# Altium schematic sheet PROGRAM.SchDoc
size 420 x 297 mm; Address1: Address1; Address2: Address2; Address3: Address3; Address4: Address4; DocumentNumber: Э3; SheetNumber: 5; SheetTotal: 5; Scale: 1:1; DocumentType: Схема электрическая принципиальная; FirstReferrence: АБВГ.123456.001
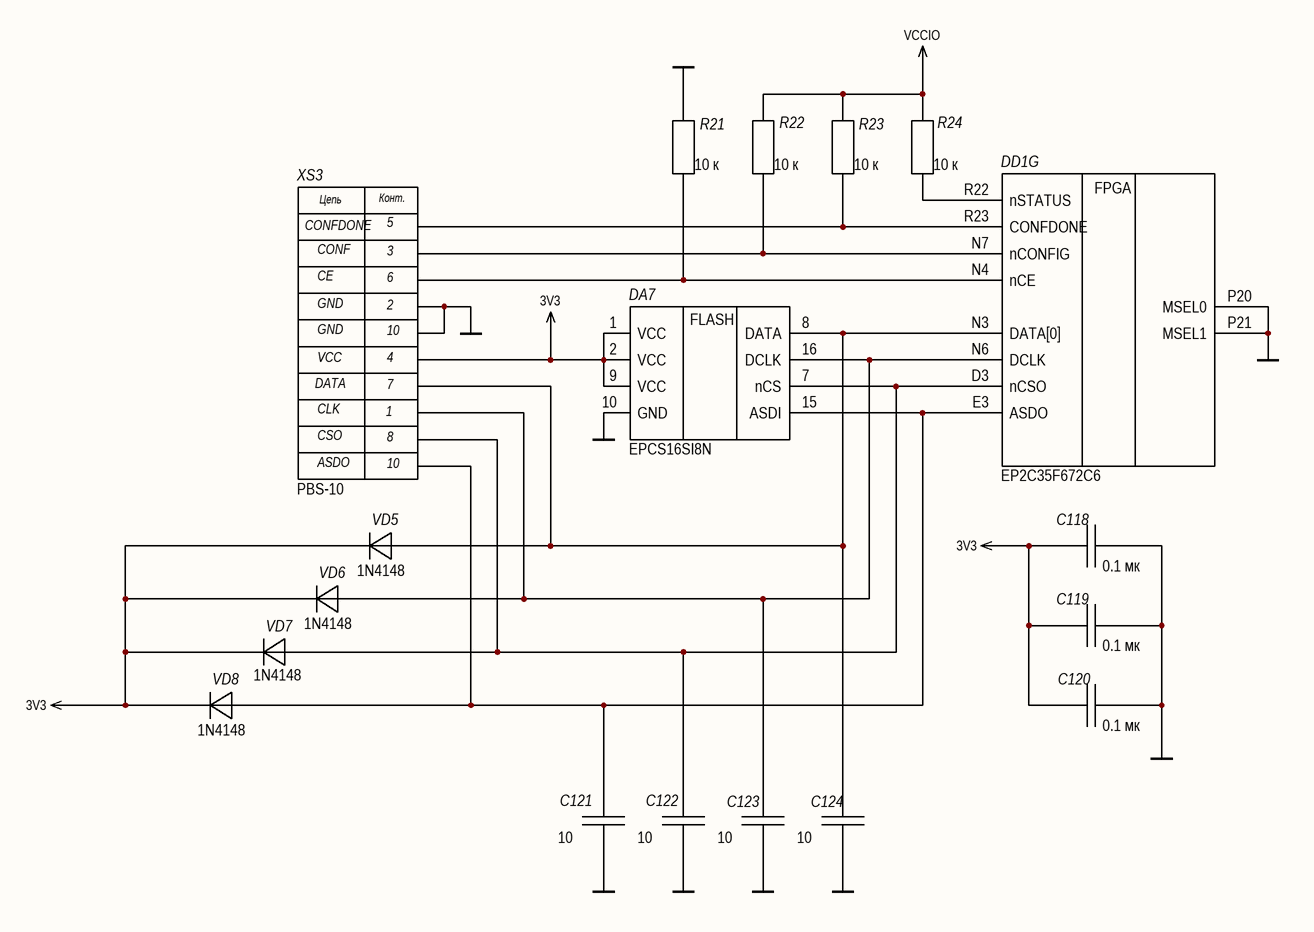
[diagram p0: PROGRAM.SchDoc]

## Parts
C118  (no value)
C119  (no value)
C120  (no value)
C121  (no value)
C122  (no value)
C123  (no value)
C124  (no value)
DA7  EPCS16SI8N
DD1  EP2C35F672C6  (part G of 7)
R21  (no value)
R22  (no value)
R23  (no value)
R24  (no value)
VD5  *  (value not drawn)
VD6  *  (value not drawn)
VD7  *  (value not drawn)
VD8  *  (value not drawn)
XS3  PBS-10

## Nets
3V3: C118.2 C119.2 C120.2 DA7.1(VCC) DA7.2(VCC) DA7.9(VCC) VD5.2 VD6.2 VD7.2 VD8.2 XS3.4
GND: C118.1 C119.1 C120.1 C121.1 C122.1 C123.1 C124.1 DA7.10(GND) DD1.P20(MSEL0) DD1.P21(MSEL1) R21.2 XS3.5 XS3.6
VCCIO: R22.2 R23.2 R24.2
NetC121_2: C121.2 DA7.15(ASDI) DD1.E3(ASDO) VD8.1 XS3.10
NetC122_2: C122.2 DA7.7(nCS) DD1.D3(nCSO) VD7.1 XS3.9
NetC123_2: C123.2 DA7.16(DCLK) DD1.N6(DCLK) VD6.1 XS3.7
NetC124_2: C124.2 DA7.8(DATA) DD1.N3(DATA[0]) VD5.1 XS3.8
NetDD1_N4: DD1.N4(nCE) R21.1 XS3.3
NetDD1_N7: DD1.N7(nCONFIG) R22.1 XS3.2
NetDD1_R22: DD1.R22(nSTATUS) R24.1
NetDD1_R23: DD1.R23(CONFDONE) R23.1 XS3.5(CONFDONE)

## Notes on the sheet
- (near R21) 10 к
- (near R22) 10 к
- (near R23) 10 к
- (near R24) 10 к
- 1N4148
- (near C118) 0.1 мк
- (near VD7) 1N4148
- (near C119) 0.1 мк
- (near VD8) 1N4148
- (near C120) 0.1 мк
- (near C121) 10
- 10
- Подп. и дата
- Инв. № дубл.
- Взам. инв. №
- Инв. № подл.
- Изм.
- Лист
- № докум.
- Подп.
- Дата
- 2.106-A3
- Копировал
- Формат А3
- (in symbol EPCS16) FLASH
- (in symbol HEADER 10PIN) Конт.; Цепь; CONF; CE; GND; VCC; DATA; CLK; 1; CSO; ASDO
- (in symbol PLIS, part G) FPGA

## Library data of the parts
C118-C124 = C: ValueType: Конденсатор
DA7 = EPCS16
DD1 = PLIS
R21-R24 = R
VD5-VD8 = diode: ValueManufacturer: On Semiconductor; ValueManufacturerPartNumber: BAT54HT1G; Value: *; URL: *; Temp: *; Case: *; ValueType: *; ValueDescription: *
XS3 = HEADER 10PIN